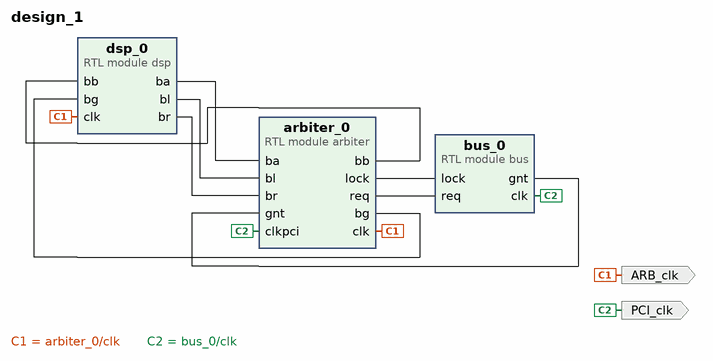
[diagram p0: block diagram of the top level]
# Vivado block design design_1, xc7a100tcsg324-1, Vivado 2019.2
create_bd_design design_1

create_bd_port -dir O -type clk PCI_clk
create_bd_port -dir O -type clk ARB_clk

create_bd_cell -type module -reference arbiter arbiter_0
create_bd_cell -type module -reference bus bus_0
create_bd_cell -type module -reference dsp dsp_0

# ---- connections ----

connect_bd_net [get_bd_pins arbiter_0/bb] [get_bd_pins dsp_0/bb]
connect_bd_net [get_bd_pins arbiter_0/bg] [get_bd_pins dsp_0/bg]
connect_bd_net [get_bd_pins arbiter_0/clk] [get_bd_ports ARB_clk] [get_bd_pins dsp_0/clk]
connect_bd_net [get_bd_pins arbiter_0/lock] [get_bd_pins bus_0/lock]
connect_bd_net [get_bd_pins arbiter_0/req] [get_bd_pins bus_0/req]
connect_bd_net [get_bd_pins bus_0/clk] [get_bd_ports PCI_clk] [get_bd_pins arbiter_0/clkpci]
connect_bd_net [get_bd_pins bus_0/gnt] [get_bd_pins arbiter_0/gnt]
connect_bd_net [get_bd_pins dsp_0/ba] [get_bd_pins arbiter_0/ba]
connect_bd_net [get_bd_pins dsp_0/bl] [get_bd_pins arbiter_0/bl]
connect_bd_net [get_bd_pins dsp_0/br] [get_bd_pins arbiter_0/br]

validate_bd_design
save_bd_design
